# Altium schematic sheet AIRZAI_BASE_BD_REVA Sheet1.SchDoc
size A2
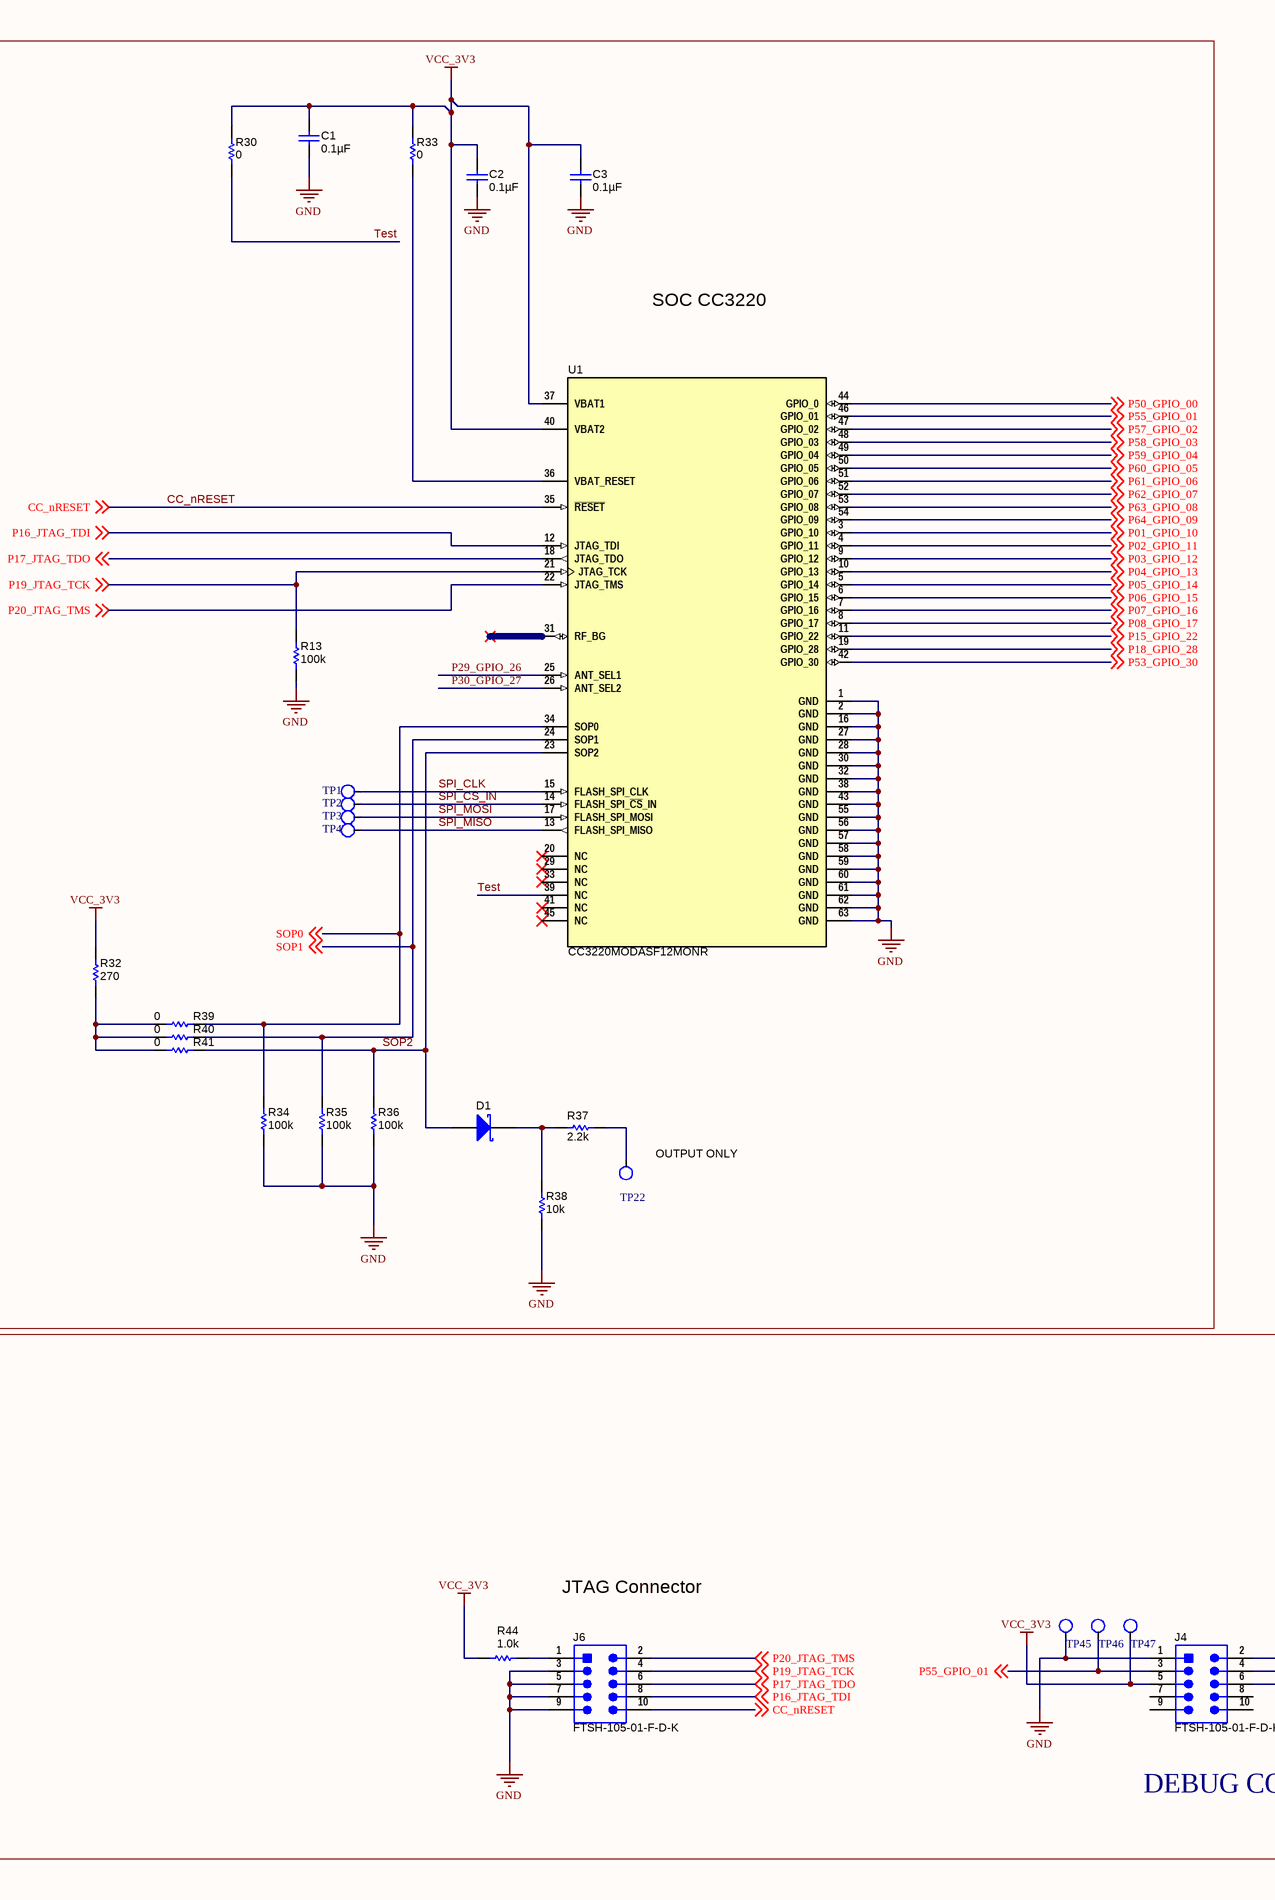
[diagram p0: AIRZAI_BASE_BD_REVA Sheet1.SchDoc, left]
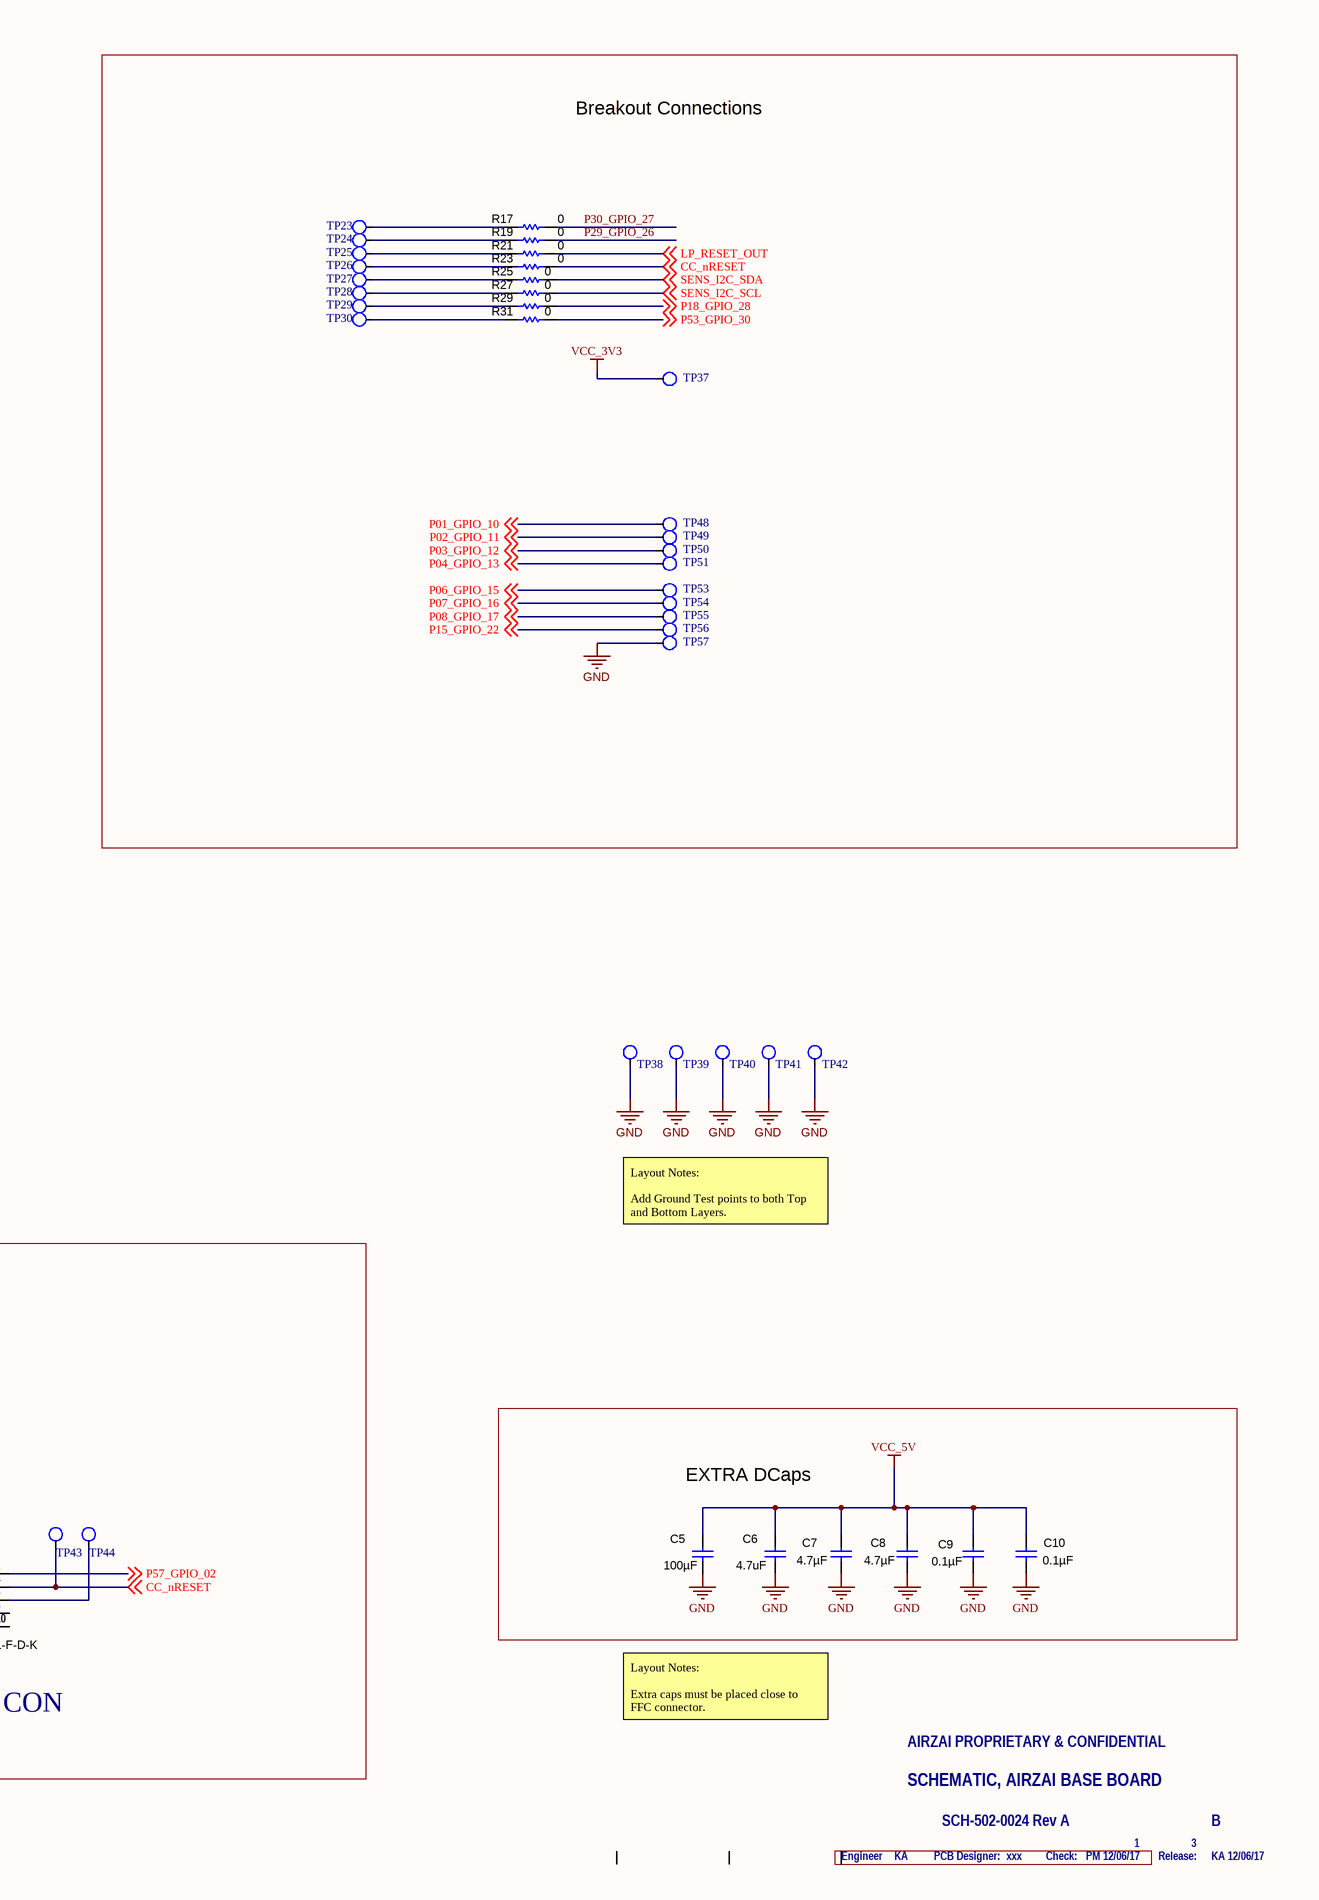
[diagram p1: AIRZAI_BASE_BD_REVA Sheet1.SchDoc, right]

## Parts
C1  ValueDisplayed: 0.1µF  [0402]  (hidden comment: GRM155R61A104KA01D)
C2  ValueDisplayed: 0.1µF  [0402]  (hidden comment: GRM155R61A104KA01D)
C3  ValueDisplayed: 0.1µF  [0402]  (hidden comment: GRM155R61A104KA01D)
C5  ValueDisplayed: 100µF  [1206_180]  (hidden comment: GRM31CR60J107ME39L)
C6  value 4.7uF  [SM0402_BTD.1SM_ACT_H55_CAP_WSS]  (hidden comment: C1005X5R0J475M050BC)
C7  ValueDisplayed: 4.7µF  [SM0402_BTD.1SM_ACT_H55_CAP_WSS]  (hidden comment: C1005X5R0J475M050BC)
C8  ValueDisplayed: 4.7µF  [SM0402_BTD.1SM_ACT_H55_CAP_WSS]  (hidden comment: C1005X5R0J475M050BC)
C9  ValueDisplayed: 0.1µF  [SM0402_BTD.1SM_ACT_H55_CAP_WSS]  (hidden comment: C1005X5R1A104K050BA)
C10  ValueDisplayed: 0.1µF  [SM0402_BTD.1SM_ACT_H55_CAP_WSS]  (hidden comment: C1005X5R1A104K050BA)
D1  CD0603-B00340  [Diode_0603]  (value not drawn)
J4  FTSH-105-01-F-D-K  [Samtec_FTSH-105-01-x-D-K]
J6  FTSH-105-01-F-D-K  [Samtec_FTSH-105-01-x-D-K]
R13  ValueDisplayed: 100k  [0402]  (hidden comment: CRCW0402100KJNED)
R17  ValueDisplayed: 0  [0402]  (hidden comment: ERJ-2GE0R00X)
R19  ValueDisplayed: 0  [0402]  (hidden comment: ERJ-2GE0R00X)
R21  ValueDisplayed: 0  [0402]  (hidden comment: ERJ-2GE0R00X)
R23  ValueDisplayed: 0  [0402]  (hidden comment: ERJ-2GE0R00X)
R25  ValueDisplayed: 0  [0402]  (hidden comment: ERJ-2GE0R00X)
R27  ValueDisplayed: 0  [0402]  (hidden comment: ERJ-2GE0R00X)
R29  ValueDisplayed: 0  [0402]  (hidden comment: ERJ-2GE0R00X)
R30  ValueDisplayed: 0  [0603]  (hidden comment: RC0603JR-070RL)
R31  ValueDisplayed: 0  [0402]  (hidden comment: ERJ-2GE0R00X)
R32  ValueDisplayed: 270  [0402]  (hidden comment: CRCW0402270RJNED)
R33  ValueDisplayed: 0  [0603]  (hidden comment: RC0603JR-070RL)
R34  ValueDisplayed: 100k  [0402]  (hidden comment: CRCW0402100KJNED)
R35  ValueDisplayed: 100k  [0402]  (hidden comment: CRCW0402100KJNED)
R36  ValueDisplayed: 100k  [0402]  (hidden comment: CRCW0402100KJNED)
R37  ValueDisplayed: 2.2k  [0402]  (hidden comment: CRCW04022K20JNED)
R38  ValueDisplayed: 10k  [0402]  (hidden comment: CRCW040210K0JNED)
R39  ValueDisplayed: 0  [0603]  (hidden comment: RC0603JR-070RL)
R40  ValueDisplayed: 0  [0603]  (hidden comment: RC0603JR-070RL)
R41  ValueDisplayed: 0  [0603]  (hidden comment: RC0603JR-070RL)
R44  ValueDisplayed: 1.0k  [0402]  (hidden comment: CRCW04021K00JNED)
TP1  WIREPT  [TP_0.9MM]  (value not drawn)
TP2  WIREPT  [TP_0.9MM]  (value not drawn)
TP3  WIREPT  [TP_0.9MM]  (value not drawn)
TP4  WIREPT  [TP_0.9MM]  (value not drawn)
TP22  WIREPT  [TP_0.9MM]  (value not drawn)
TP23  WIREPT  [TP_0.9MM]  (value not drawn)
TP24  WIREPT  [TP_0.9MM]  (value not drawn)
TP25  WIREPT  [TP_0.9MM]  (value not drawn)
TP26  WIREPT  [TP_0.9MM]  (value not drawn)
TP27  WIREPT  [TP_0.9MM]  (value not drawn)
TP28  WIREPT  [TP_0.9MM]  (value not drawn)
TP29  WIREPT  [TP_0.9MM]  (value not drawn)
TP30  WIREPT  [TP_0.9MM]  (value not drawn)
TP37  WIREPT  [TP_0.9MM]  (value not drawn)
TP38  WIREPT  [TP_0.9MM]  (value not drawn)
TP39  WIREPT  [TP_0.9MM]  (value not drawn)
TP40  WIREPT  [TP_0.9MM]  (value not drawn)
TP41  WIREPT  [TP_0.9MM]  (value not drawn)
TP42  WIREPT  [TP_0.9MM]  (value not drawn)
TP43  WIREPT  [TP_0.9MM]  (value not drawn)
TP44  WIREPT  [TP_0.9MM]  (value not drawn)
TP45  WIREPT  [TP_0.9MM]  (value not drawn)
TP46  WIREPT  [TP_0.9MM]  (value not drawn)
TP47  WIREPT  [TP_0.9MM]  (value not drawn)
TP48  WIREPT  [TP_0.9MM]  (value not drawn)
TP49  WIREPT  [TP_0.9MM]  (value not drawn)
TP50  WIREPT  [TP_0.9MM]  (value not drawn)
TP51  WIREPT  [TP_0.9MM]  (value not drawn)
TP53  WIREPT  [TP_0.9MM]  (value not drawn)
TP54  WIREPT  [TP_0.9MM]  (value not drawn)
TP55  WIREPT  [TP_0.9MM]  (value not drawn)
TP56  WIREPT  [TP_0.9MM]  (value not drawn)
TP57  WIREPT  [TP_0.9MM]  (value not drawn)
U1  CC3220MODASF12MONR  [MON0063A]

## Blocks framed on the sheet
SOC CC3220: C1-C3 D1 R13 R30 R32-R41 TP1-TP4 TP22 U1
Breakout Connections: R17 R19 R21 R23 R25 R27 R29 R31 TP23-TP30 TP37 TP48-TP51 TP53-TP57
DEBUG CON: J4 J6 R44 TP43-TP47
EXTRA DCaps: C5-C10

## Nets
GND: C1.2 C2.2 C3.2 C5.2 C6.2 C7.2 C8.2 C9.2 C10.2 J4.1 J6.3 J6.5 J6.7 J6.9 R13.2 R34.1 R35.2 R36.2 R38.2 TP38.1 TP39.1 TP40.1 TP41.1 TP42.1 TP45.1 TP57.1 U1.1(GND) U1.2(GND) U1.16(GND) U1.27(GND) U1.28(GND) U1.30(GND) U1.32(GND) U1.38(GND) U1.43(GND) U1.55(GND) U1.56(GND) U1.57(GND) U1.58(GND) U1.59(GND) U1.60(GND) U1.61(GND) U1.62(GND) U1.63(GND)
VCC_3V3: C1.1 C2.1 C3.1 J4.5 R30.2 R32.1 R33.2 R44.1 TP37.1 TP47.1 U1.37(VBAT1) U1.40(VBAT2)
VCC_5V: C5.1 C6.1 C7.1 C8.1 C9.1 C10.1
CC_nRESET: J4.4 J6.10 R23.2 TP43.1 U1.35(~{RESET}) ; off-sheet CC_nRESET
LP_RESET_OUT: R21.2 ; off-sheet LP_RESET_OUT
P01_GPIO_10: TP48.1 U1.3(GPIO_10) ; off-sheet P01_GPIO_10
P02_GPIO_11: TP49.1 U1.4(GPIO_11) ; off-sheet P02_GPIO_11
P03_GPIO_12: TP50.1 U1.9(GPIO_12) ; off-sheet P03_GPIO_12
P04_GPIO_13: TP51.1 U1.10(GPIO_13) ; off-sheet P04_GPIO_13
P05_GPIO_14: U1.5(GPIO_14) ; off-sheet P05_GPIO_14
P06_GPIO_15: TP53.1 U1.6(GPIO_15) ; off-sheet P06_GPIO_15
P07_GPIO_16: TP54.1 U1.7(GPIO_16) ; off-sheet P07_GPIO_16
P08_GPIO_17: TP55.1 U1.8(GPIO_17) ; off-sheet P08_GPIO_17
P15_GPIO_22: TP56.1 U1.11(GPIO_22) ; off-sheet P15_GPIO_22
P16_JTAG_TDI: J6.8 U1.12(JTAG_TDI) ; off-sheet P16_JTAG_TDI
P17_JTAG_TDO: J6.6 U1.18(JTAG_TDO) ; off-sheet P17_JTAG_TDO
P18_GPIO_28: R29.2 U1.19(GPIO_28) ; off-sheet P18_GPIO_28
P19_JTAG_TCK: J6.4 R13.1 U1.21(JTAG_TCK) ; off-sheet P19_JTAG_TCK
P20_JTAG_TMS: J6.2 U1.22(JTAG_TMS) ; off-sheet P20_JTAG_TMS
P29_GPIO_26: R19.2 U1.25(ANT_SEL1)
P30_GPIO_27: R17.2 U1.26(ANT_SEL2)
P50_GPIO_00: U1.44(GPIO_0) ; off-sheet P50_GPIO_00
P53_GPIO_30: R31.2 U1.42(GPIO_30) ; off-sheet P53_GPIO_30
P55_GPIO_01: J4.3 TP46.1 U1.46(GPIO_01) ; off-sheet P55_GPIO_01
P57_GPIO_02: J4.2 U1.47(GPIO_02) ; off-sheet P57_GPIO_02
P58_GPIO_03: U1.48(GPIO_03) ; off-sheet P58_GPIO_03
P59_GPIO_04: U1.49(GPIO_04) ; off-sheet P59_GPIO_04
P60_GPIO_05: U1.50(GPIO_05) ; off-sheet P60_GPIO_05
P61_GPIO_06: U1.51(GPIO_06) ; off-sheet P61_GPIO_06
P62_GPIO_07: U1.52(GPIO_07) ; off-sheet P62_GPIO_07
P63_GPIO_08: U1.53(GPIO_08) ; off-sheet P63_GPIO_08
P64_GPIO_09: U1.54(GPIO_09) ; off-sheet P64_GPIO_09
SENS_I2C_SCL: R27.2 ; off-sheet SENS_I2C_SCL
SENS_I2C_SDA: R25.2 ; off-sheet SENS_I2C_SDA
SOP0: R34.2 R39.1 U1.34(SOP0) ; off-sheet SOP0
SOP1: R35.1 R40.1 U1.24(SOP1) ; off-sheet SOP1
SOP2: D1.2(A) R36.1 R41.1 U1.23(SOP2)
SPI_CLK: TP1.1 U1.15(FLASH_SPI_CLK)
SPI_CS_IN: TP2.1 U1.14(FLASH_SPI_~{CS}_IN)
SPI_MISO: TP4.1 U1.13(FLASH_SPI_MISO)
SPI_MOSI: TP3.1 U1.17(FLASH_SPI_MOSI)
Test: R30.1 U1.39(NC)
NetD1_1: D1.1(K) R37.1 R38.1
NetJ4_6: J4.6 TP44.1
NetJ6_1: J6.1 R44.2
NetR17_1: R17.1 TP23.1
NetR19_1: R19.1 TP24.1
NetR21_1: R21.1 TP25.1
NetR23_1: R23.1 TP26.1
NetR25_1: R25.1 TP27.1
NetR27_1: R27.1 TP28.1
NetR29_1: R29.1 TP29.1
NetR31_1: R31.1 TP30.1
NetR32_2: R32.2 R39.2 R40.2 R41.2
NetR33_1: R33.1 U1.36(VBAT_RESET)
NetR37_2: R37.2 TP22.1

Not connected (* = marked no-connect by the designer): J4 7 8 9 10; U1 20(NC)* 29(NC)* 31(RF_BG)* 33(NC)* 41(NC)* 45(NC)*

## Notes on the sheet
- (near TP22) OUTPUT ONLY
- Layout Notes:
  Add Ground Test points to both Top and Bottom Layers.
- JTAG Connector
- Layout Notes:
  Extra caps must be placed close to FFC connector.
- SCHEMATIC, AIRZAI BASE BOARD
- AIRZAI PROPRIETARY & CONFIDENTIAL
- Engineer
- KA
- PCB Designer:
- SCH-502-0024 Rev A
- xxx
- Check:
- PM 12/06/17
- 1
- Release:
- 3
- B
- KA 12/06/17

## Library data of the parts
C1-C3 = GRM155R61A104KA01D: CAP, CERM, 0.1 µF, 10 V, +/- 10%, X5R, 0402; Manufacturer: MuRata; Polarized: N; CompType: Capacitor; Value: 0.1uF; U/M: EA; Cap_F: 0.0000001; Tolerance_%: 10; Value1: Unknown; Value2: 10V; TaMin_C: -55; TaMax_C: 85; SizeArea_mm2: 0.5; SizeAreaWB_mm2: 3; SizeX_mm: 1; SizeZ_mm: 0.6; AEC Category: Q200; SymbolVersion: 2008-07-09; PartNumber: GRM155R61A104KA01D; PackageReference: 0402; RoHS: Y; VDC_V: 10; MountType: SMT; Technology: Ceramic; TempCo: X5R; Cap_Case: 0402; SizeY_mm: 0.5; Published: 2008-06-19; Publisher: Texas Instruments; LatestRevisionDate: 2016-08-14; ComponentLink1Description: Datasheet link; ComponentLink1URL: http://search.murata.co.jp/Ceramy/PnsearchViewAction.do?HnOFG=ON&HnNFG=ON&SEL_CNT=50&sLang=en&sKey=GRM155R61A104KA01D&x=9&y=9&search=startwith; Supplier 1: Digi-Key; Supplier Part Number 1: 490-1318-1-ND; Supplier 2: Mouser; Supplier Part Number 2: 81-GRM155R61A104KA01; Supplier 3: Farnell; Supplier Part Number 3: 1828862; AEC Qualified: ?
C5 = GRM31CR60J107ME39L: CAP, CERM, 100 µF, 6.3 V, +/- 20%, X5R, 1206; Manufacturer: MuRata; Polarized: N; CompType: Capacitor; Value: 100uF; U/M: EA; Cap_F: 0.0001; Tolerance_%: 20; ESR_ohm: 0.003; Value1: 0.003 ohm; VDC_V: 6.3; Value2: 6.3V; TaMin_C: -55; TaMax_C: 85; Cap_Case: 1206; SizeArea_mm2: 5.12; SizeAreaWB_mm2: 10.92; SizeX_mm: 3.2; SizeY_mm: 1.6; SizeZ_mm: 1.8; AEC Category: Q200; SymbolVersion: 2008-07-09; PartNumber: GRM31CR60J107ME39L; PackageReference: 1206; RoHS: Y; MountType: SMT; Technology: Ceramic; TempCo: X5R; Published: 2008-06-19; Publisher: Texas Instruments; LatestRevisionDate: 2016-07-02; ComponentLink1Description: Datasheet link; ComponentLink1URL: http://search.murata.co.jp/Ceramy/PnsearchViewAction.do?HnOFG=ON&HnNFG=ON&SEL_CNT=50&sLang=en&sKey=GRM31CR60J107ME39L&x=9&y=9&search=startwith; Supplier 1: Digi-Key; Supplier Part Number 1: 490-4539-1-ND; Supplier 2: Mouser; Supplier Part Number 2: 81-GRM31CR60J107ME9L; Supplier 3: Farnell; Supplier Part Number 3: 1735535; AEC Qualified: ?
C6 = C1005X5R0J475M050BC: CAP, CERM, 4.7 µF, 6.3 V, +/- 20%, X5R, 0402; Manufacturer: TDK; PartNumber: C1005X5R0J475M050BC
C7 C8 = C1005X5R0J475M050BC: CAP, CERM, 4.7 µF, 6.3 V, +/- 20%, X5R, 0402; Manufacturer: TDK; Polarized: N; CompType: Capacitor; Value: 4.7uF; U/M: EA; Cap_F: 0.0000047; Tolerance_%: 20; Value1: Unknown; VDC_V: 6.3; Value2: 6.3V; TaMin_C: -55; TaMax_C: 85; Cap_Case: 0402; SymbolVersion: 2008-07-09; PartNumber: C1005X5R0J475M050BC; PackageReference: 0402; RoHS: Y; MountType: SMT; Technology: Ceramic; TempCo: X5R; Published: 2008-06-19; Publisher: Texas Instruments; LatestRevisionDate: 2015-02-23; ComponentLink1Description: Datasheet link; ComponentLink1URL: http://www.tdk.com/pdf/TDKMLCCCapRange.pdf; Supplier 1: Digi-Key; Supplier Part Number 1: 445-7395-1-ND; Supplier 2: Farnell; Supplier Part Number 2: 1962109; Supplier 3: Newark; Supplier Part Number 3: 48T2906
C9 = C1005X5R1A104K050BA: CAP, CERM, 0.1 µF, 10 V, +/- 10%, X5R, 0402; Manufacturer: TDK; Polarized: N; CompType: Capacitor; Value: 0.1uF; U/M: EA; Cap_F: 0.0000001; Tolerance_%: 10; Value1: Unknown; Value2: 10V; TaMin_C: -55; TaMax_C: 85; Cap_Case: 0402; SymbolVersion: 2008-07-09; PartNumber: C1005X5R1A104K050BA; PackageReference: 0402; RoHS: Y; VDC_V: 10; MountType: SMT; Technology: Ceramic; TempCo: X5R; Published: 2008-06-19; Publisher: Texas Instruments; LatestRevisionDate: 2015-02-23; ComponentLink1Description: Datasheet link; ComponentLink1URL: http://product.tdk.com/en/catalog/datasheets/mlcc_commercial_general_en.pdf; Supplier 1: Digi-Key; Supplier Part Number 1: 445-1265-1-ND; Supplier 2: Mouser; Supplier Part Number 2: 810-C1005X5R1A104K; Supplier 3: Farnell; Supplier Part Number 3: 2368215
C10 = C1005X5R1A104K050BA: CAP, CERM, 0.1 µF, 10 V, +/- 10%, X5R, 0402; Manufacturer: TDK; Polarized: N; CompType: Capacitor; Value: 0.1uF; U/M: EA; Cap_F: 0.0000001; Tolerance_%: 10; Value1: Unknown; Value2: 10V; TaMin_C: -55; TaMax_C: 85; Cap_Case: SM0402_BTD.1SM_ACT; SymbolVersion: 2008-07-09; PartNumber: C1005X5R1A104K050BA; PackageReference: 0402; RoHS: Y; VDC_V: 10; MountType: SMT; Technology: Ceramic; TempCo: X5R; Published: 2008-06-19; Publisher: Texas Instruments; LatestRevisionDate: 2015-02-23; ComponentLink1Description: Datasheet link; ComponentLink1URL: http://product.tdk.com/en/catalog/datasheets/mlcc_commercial_general_en.pdf; Supplier 1: Digi-Key; Supplier Part Number 1: 445-1265-1-ND; Supplier 2: Mouser; Supplier Part Number 2: 810-C1005X5R1A104K; Supplier 3: Farnell; Supplier Part Number 3: 2368215
D1 = CD0603-B00340: Diode, Schottky, 45 V, 0.03 A, 0603 Diode; Manufacturer: Bourns; U/M: EA; Vf_V: 0.37; Value: 45V; Value1: 0.03A; Value2: 0.37V; Io_A: 0.03; Vr_V: 45; TJmax_C: 125; AEC Category: Q101; SizeAreaWB_mm2: 5.13; SizeArea_mm2: 1.53; SizeX_mm: 1.7; SizeY_mm: 0.9; SizeZ_mm: 0.75; CompType: Diode; SymbolVersion: 2008-12-08; PartNumber: CD0603-B00340; PackageReference: 0603 Diode; MountType: SMT; Type: Schottky; RoHS: Y; Published: 2008-06-26; Publisher: Texas Instruments; LatestRevisionDate: 2016-07-03; ComponentLink1Description: Datasheet link; ComponentLink1URL: http://www.bourns.com/pdfs/SBCD0603_1005.pdf; Supplier 1: Mouser; Supplier Part Number 1: 652-CD0603-B00340; Supplier 2: Farnell; Supplier Part Number 2: 1456534; AEC Qualified: ?
J4 J6 = FTSH-105-01-F-D-K: Header, 1.27 mm, 5x2, Gold, TH; Manufacturer: Samtec; SymbolCreator: a0412235; Pitch_mm: 1.27; Gender: Male; Shrouded: Y; Row_Count: 2; SymbolVersion: 2013-12-22; PartNumber: FTSH-105-01-F-D-K; PackageReference: Header, 1.27 mm, 5x2, TH; CompType: Header; RoHS: Y; MountType: TH; ComponentLink1Description: Datasheet URL; ComponentLink1URL: https://www.samtec.com/ftppub/cpdf/FTSH-1XX-XX-XXX-D-XX-MKT.pdf; Publisher: Texas Instruments; LatestRevisionDate: 2016-07-01; Supplier 1: Digi-Key; Supplier Part Number 1: FTSH-105-01-F-D-K-ND; Orientation: Vertical; PinCount: 10; RowSpacing_mm: 1.27; ContactFinish: Gold; Color: Black
R13 R35 R36 = CRCW0402100KJNED: RES, 100 k, 5%, 0.063 W, 0402; Manufacturer: Vishay-Dale; CompType: Resistor; Value: 100k; Res_ohm: 100000; Tolerance_%: 5; Power_W: 0.063; Value2: 0.063W; VDC_V: 50; TempCo: 200 ppm/C; EIA_Code: E24; U/M: EA; SizeArea_mm2: 0.5; SizeX_mm: 1; SizeZ_mm: 0.6; AEC Category: Q200; SymbolVersion: 2009-05-29; PartNumber: CRCW0402100KJNED; PackageReference: 0402; RoHS: Y; Value_Code: 100k; Value1: 5%; MountType: SMT; Technology: Thick Film; Published: 2008-06-26; Publisher: Texas Instruments; LatestRevisionDate: 2016-07-01; ComponentLink1Description: Datasheet link; ComponentLink1URL: http://www.vishay.com/docs/20035/dcrcwe3.pdf; Supplier 1: Digi-Key; Supplier Part Number 1: 541-100KJCT-ND; Supplier 2: Mouser; Supplier Part Number 2: 71-CRCW0402J-100K-E3; Supplier 3: Farnell; Supplier Part Number 3: 1652738; SizeY_mm: 0.5; AEC Qualified: ?
R17 R19 R21 R23 R25 R27 R29 R31 = ERJ-2GE0R00X: RES, 0, 5%, 0.063 W, 0402; Manufacturer: Panasonic; CompType: Resistor; Value: 0; Value_Code: 0000; Tolerance_%: 5; Power_W: 0.063; Value2: 0.063W; VDC_V: 50; TempCo: 600 ppm/C; EIA_Code: E24; U/M: EA; SizeArea_mm2: 0.5; SizeX_mm: 1; SizeZ_mm: 0.6; AEC Category: Q200; SymbolVersion: 2009-05-29; PartNumber: ERJ-2GE0R00X; PackageReference: 0402; RoHS: Y; Res_ohm: 0; Value1: 5%; MountType: SMT; Technology: Thick Film; Published: 2008-06-26; Publisher: Texas Instruments; LatestRevisionDate: 2016-07-01; ComponentLink1Description: Datasheet link; ComponentLink1URL: http://www.panasonic.com/industrial/components/pdf/AOA0000CE1.pdf; Supplier 1: Digi-Key; Supplier Part Number 1: P0.0JCT-ND; Supplier 2: Mouser; Supplier Part Number 2: 667-ERJ-2GE0R00X; Supplier 3: Farnell; Supplier Part Number 3: 2059190; SizeY_mm: 0.5; AEC Qualified: ?
R30 R33 R39-R41 = ERJ-2GE0R00X: RES, 0, 5%, 0.1 W, 0603; Manufacturer: Yageo; Value: 0; Value_Code: 0000; Value2: 0.1W; VDC_V: 50; Resistance: 0mR; Tolerance: 1%; Voltage Rating: 50V; Power Rating: 100mW; Temperature Coefficient: 200ppm/°C; Value1: 5%; ComponentLink1Description: Datasheet link; ComponentLink1URL: http://www.panasonic.com/industrial/components/pdf/AOA0000CE1.pdf; Supplier 1: Digi-Key; Supplier Part Number 1: 311-0.0GRDKR-ND; Manufacturer Part Number: RC0603JR-070RL; Stock 1: 47590704; Pricing 1: 1=0.1, 10=0.021, 25=0.0152, 50=0.0114, 100=0.0084, 250=0.00644, 500=0.00514, 1000=0.00379 (USD); Case/Package: 0603; Number of Pins: 2; Case Code (Imperial): 0603; Case Code (Metric): 1608; Contact Plating: Tin,Matte; Min Operating Temperature: -55°C; Max Operating Temperature: 155°C; Package Quantity: 5000; Packaging: Tape and Reel; Voltage Rating (DC): 50V; Termination: SMD/SMT; Composition: Thick Film; Military Standard: Not; Length: 1.6mm; Height: 0.45mm; Width: 0.8mm; Depth: 0.8mm; Radiation Hardening: No; REACH SVHC: No SVHC; Lead Free: Lead Free; ComponentLink2URL: http://www.farnell.com/datasheets/1868787.pdf?src-supplier=Element14; ComponentLink2Description: http://www.farnell.com/datasheets/1868787.pdf?src-supplier=Element14; ComponentLink3URL: https://www.verical.com/server-webapp/html/getDatasheet?partID=329462&src-supplier=Verical; ComponentLink3Description: https://www.verical.com/server-webapp/html/getDatasheet?partID=329462&src-supplier=Verical; ComponentLink4URL: http://www.yageo.com/documents/recent/PYu-RC_Group_51_RoHS_L_9.pdf?src-supplier=Mouser; ComponentLink4Description: http://www.yageo.com/documents/recent/PYu-RC_Group_51_RoHS_L_9.pdf?src-supplier=Mouser; ComponentLink5URL: http://www.farnell.com/datasheets/443971.pdf?src-supplier=Element14; ComponentLink5Description: http://www.farnell.com/datasheets/443971.pdf?src-supplier=Element14; ComponentLink6URL: http://documents.rs-components.com/techlib://itc_doclist_GB.htm?stockno=6515918&src-supplier=RSComponents; ComponentLink6Description: http://documents.rs-components.com/techlib://itc_doclist_GB.htm?stockno=6515918&src-supplier=RSComponents; PartNumber: RC0603JR-070RL
R32 = CRCW0402270RJNED: RES, 270, 5%, 0.063 W, 0402; Manufacturer: Vishay-Dale; CompType: Resistor; Value: 270; Value_Code: 270R; Tolerance_%: 5; Power_W: 0.063; Value2: 0.063W; VDC_V: 50; TempCo: 200 ppm/C; EIA_Code: E24; U/M: EA; SizeArea_mm2: 0.5; SizeX_mm: 1; SizeZ_mm: 0.6; AEC Category: Q200; SymbolVersion: 2009-05-29; PartNumber: CRCW0402270RJNED; PackageReference: 0402; RoHS: Y; Res_ohm: 270; Value1: 5%; MountType: SMT; Technology: Thick Film; Published: 2008-06-26; Publisher: Texas Instruments; LatestRevisionDate: 2016-07-01; ComponentLink1Description: Datasheet link; ComponentLink1URL: http://www.vishay.com/docs/20035/dcrcwe3.pdf; Supplier 1: Digi-Key; Supplier Part Number 1: 541-270JCT-ND; Supplier 2: Mouser; Supplier Part Number 2: 71-CRCW0402J-270-E3; Supplier 3: Farnell; Supplier Part Number 3: 1514691; SizeY_mm: 0.5; AEC Qualified: ?
R34 = CRCW0402100KJNED: RES, 100 k, 5%, 0.063 W, 0402; Manufacturer: Vishay-Dale; CompType: Resistor; Value: 100k; Res_ohm: 100000; Tolerance_%: 5; Power_W: 0.063; Value2: 0.063W; VDC_V: 50; TempCo: 200 ppm/C; SizeArea_mm2: 0.5; SizeX_mm: 1; SizeZ_mm: 0.6; EIA_Code: E24; U/M: EA; AEC Category: Q200; SymbolVersion: 2009-05-29; PartNumber: CRCW0402100KJNED; PackageReference: 0402; RoHS: Y; Value_Code: 100k; Value1: 5%; MountType: SMT; Technology: Thick Film; SizeY_mm: 0.5; Published: 2008-06-26; Publisher: Texas Instruments; LatestRevisionDate: 2016-07-01; ComponentLink1Description: Datasheet link; ComponentLink1URL: http://www.vishay.com/docs/20035/dcrcwe3.pdf; Supplier 1: Digi-Key; Supplier Part Number 1: 541-100KJCT-ND; Supplier 2: Mouser; Supplier Part Number 2: 71-CRCW0402J-100K-E3; Supplier 3: Farnell; Supplier Part Number 3: 1652738; AEC Qualified: ?
R37 = CRCW04022K20JNED: RES, 2.2 k, 5%, 0.063 W, 0402; Manufacturer: Vishay-Dale; CompType: Resistor; Value: 2.2k; Res_ohm: 2200; Value_Code: 2k20; Tolerance_%: 5; Power_W: 0.063; Value2: 0.063W; VDC_V: 50; TempCo: 200 ppm/C; EIA_Code: E24; U/M: EA; AEC Category: Q200; SizeArea_mm2: 0.5; SizeX_mm: 1; SizeZ_mm: 0.6; SymbolVersion: 2009-05-29; PartNumber: CRCW04022K20JNED; PackageReference: 0402; RoHS: Y; Value1: 5%; MountType: SMT; Technology: Thick Film; Published: 2008-06-26; Publisher: Texas Instruments; LatestRevisionDate: 2016-07-01; ComponentLink1Description: Datasheet link; ComponentLink1URL: http://www.vishay.com/docs/20035/dcrcwe3.pdf; Supplier 1: Digi-Key; Supplier Part Number 1: 541-2.2KJCT-ND; Supplier 2: Mouser; Supplier Part Number 2: 71-CRCW0402J-2.2K-E3; Supplier 3: Farnell; Supplier Part Number 3: 1514678; AEC Qualified: ?; SizeY_mm: 0.5
R38 = CRCW040210K0JNED: RES, 10 k, 5%, 0.063 W, 0402; Manufacturer: Vishay-Dale; CompType: Resistor; Value: 10k; Res_ohm: 10000; Value_Code: 10k0; Tolerance_%: 5; Power_W: 0.063; Value2: 0.063W; VDC_V: 50; TempCo: 200 ppm/C; EIA_Code: E24; U/M: EA; SizeArea_mm2: 0.5; SizeX_mm: 1; SizeZ_mm: 0.6; AEC Category: Q200; SymbolVersion: 2009-05-29; PartNumber: CRCW040210K0JNED; PackageReference: 0402; RoHS: Y; Value1: 5%; MountType: SMT; Technology: Thick Film; Published: 2008-06-26; Publisher: Texas Instruments; LatestRevisionDate: 2016-07-01; ComponentLink1Description: Datasheet link; ComponentLink1URL: http://www.vishay.com/docs/20035/dcrcwe3.pdf; Supplier 1: Digi-Key; Supplier Part Number 1: 541-10KJCT-ND; Supplier 2: Mouser; Supplier Part Number 2: 71-CRCW0402J-10K-E3; Supplier 3: Farnell; Supplier Part Number 3: 1514663; SizeY_mm: 0.5; AEC Qualified: ?
R44 = CRCW04021K00JNED: RES, 1.0 k, 5%, 0.063 W, 0402; Manufacturer: Vishay-Dale; CompType: Resistor; Value: 1.0k; Res_ohm: 1000; Value_Code: 1k00; Tolerance_%: 5; Power_W: 0.063; Value2: 0.063W; VDC_V: 50; TempCo: 200 ppm/C; EIA_Code: E24; U/M: EA; SizeArea_mm2: 0.5; SizeX_mm: 1; SizeZ_mm: 0.6; AEC Category: Q200; SymbolVersion: 2009-05-29; PartNumber: CRCW04021K00JNED; PackageReference: 0402; RoHS: Y; Value1: 5%; MountType: SMT; Technology: Thick Film; Published: 2008-06-26; Publisher: Texas Instruments; LatestRevisionDate: 2016-07-01; ComponentLink1Description: Datasheet link; ComponentLink1URL: http://www.vishay.com/docs/20035/dcrcwe3.pdf; Supplier 1: Digi-Key; Supplier Part Number 1: 541-1.0KJCT-ND; Supplier 2: Mouser; Supplier Part Number 2: 71-CRCW0402J-1.0K-E3; Supplier 3: Farnell; Supplier Part Number 3: 1514656; SizeY_mm: 0.5; AEC Qualified: ?
U1 = CC3220MODASF12MONR: SimpleLink Wi-Fi and Internet-of-Things Module Solution, a Single-Chip Wireless MCU, MON0063A (QFM-63); Alternate PartNumber: XCC3220MODASF12MONR; Manufacturer: Texas Instruments; SymbolCreator: Altium; SizeArea_mm2: 522.75; SizeAreaWB_mm2: 618.75; SizeX_mm: 25.5; SizeY_mm: 20.5; SizeZ_mm: 2.45; CompType: IC; U/M: EA; SymbolVersion: 2017-05-11; PartNumber: CC3220MODASF12MONR; PackageReference: MON0063A; PackageDescription: QFM-63; MountType: SMT; ComponentLink1Description: Datasheet Link; ComponentLink1URL: https://sps06.itg.ti.com/sites/KMS/crossdivteams/altium/docs/ComponentDatasheets/t77h533-20_ANT%20module%20dimension_2016-0910.pdf; Publisher: Texas Instruments; LatestRevisionDate: 2017-05-12; Alternate Manufacturer: Texas Instruments